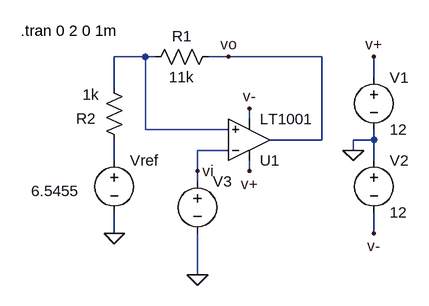
[diagram p0: schematic comparadores3.asc]
comparadores3.asc, the LTspice schematic file:
Version 4
SHEET 1 1884 820
WIRE 48 160 0 160
WIRE 64 160 48 160
WIRE 176 160 144 160
WIRE 320 160 176 160
WIRE 400 192 400 160
WIRE 0 208 0 160
WIRE 208 256 208 240
WIRE 48 272 48 160
WIRE 176 272 48 272
WIRE 320 288 320 160
WIRE 320 288 240 288
WIRE 400 288 400 272
WIRE 400 288 368 288
WIRE 176 304 128 304
WIRE 368 304 368 288
WIRE 0 320 0 288
WIRE 400 320 400 288
WIRE 128 336 128 304
WIRE 208 336 208 320
WIRE 128 352 128 336
WIRE 0 432 0 400
WIRE 400 432 400 400
WIRE 128 496 128 432
FLAG 0 432 0
FLAG 128 496 0
FLAG 128 336 vi
FLAG 176 160 vo
FLAG 208 240 v-
FLAG 208 336 v+
FLAG 400 160 v+
FLAG 400 432 v-
FLAG 368 304 0
SYMBOL res 160 144 R90
WINDOW 0 0 56 VBottom 2
WINDOW 3 32 56 VTop 2
SYMATTR InstName R1
SYMATTR Value 11k
SYMBOL res -16 192 R0
WINDOW 0 -43 63 Left 2
WINDOW 3 -33 26 Left 2
SYMATTR InstName R2
SYMATTR Value 1k
SYMBOL voltage 0 304 R0
WINDOW 3 -128 63 Left 2
WINDOW 123 0 0 Left 2
WINDOW 39 0 0 Left 2
SYMATTR Value 6.5455
SYMATTR InstName Vref
SYMBOL voltage 128 336 R0
WINDOW 3 24 96 Invisible 2
WINDOW 123 0 0 Left 2
WINDOW 39 0 0 Left 2
SYMATTR Value PULSE(-12 12 0 1 1 .000001 2.000001)
SYMATTR InstName V3
SYMBOL OpAmps\\LT1001 208 352 M180
SYMATTR InstName U1
SYMBOL voltage 400 176 R0
WINDOW 123 0 0 Left 0
WINDOW 39 0 0 Left 0
SYMATTR InstName V1
SYMATTR Value 12
SYMBOL voltage 400 304 R0
WINDOW 123 0 0 Left 0
WINDOW 39 0 0 Left 0
SYMATTR InstName V2
SYMATTR Value 12
TEXT -144 120 Left 2 !.tran 0 2 0 1m

The netlist it stands for:
* comparadores3.asc
R1 vo N001 11k
R2 N001 N002 1k
Vref N002 0 6.5455
V3 vi 0 PULSE(-12 12 0 1 1 .000001 2.000001)
XU1 N001 vi v+ v- vo LT1001  ; pins In+ In- V+ V- OUT
V1 v+ 0 12
V2 0 v- 12
.tran 0 2 0 1m
.lib LTC.lib
.backanno
.end